# Altium schematic sheet FX_HT32.SchDoc
size A3
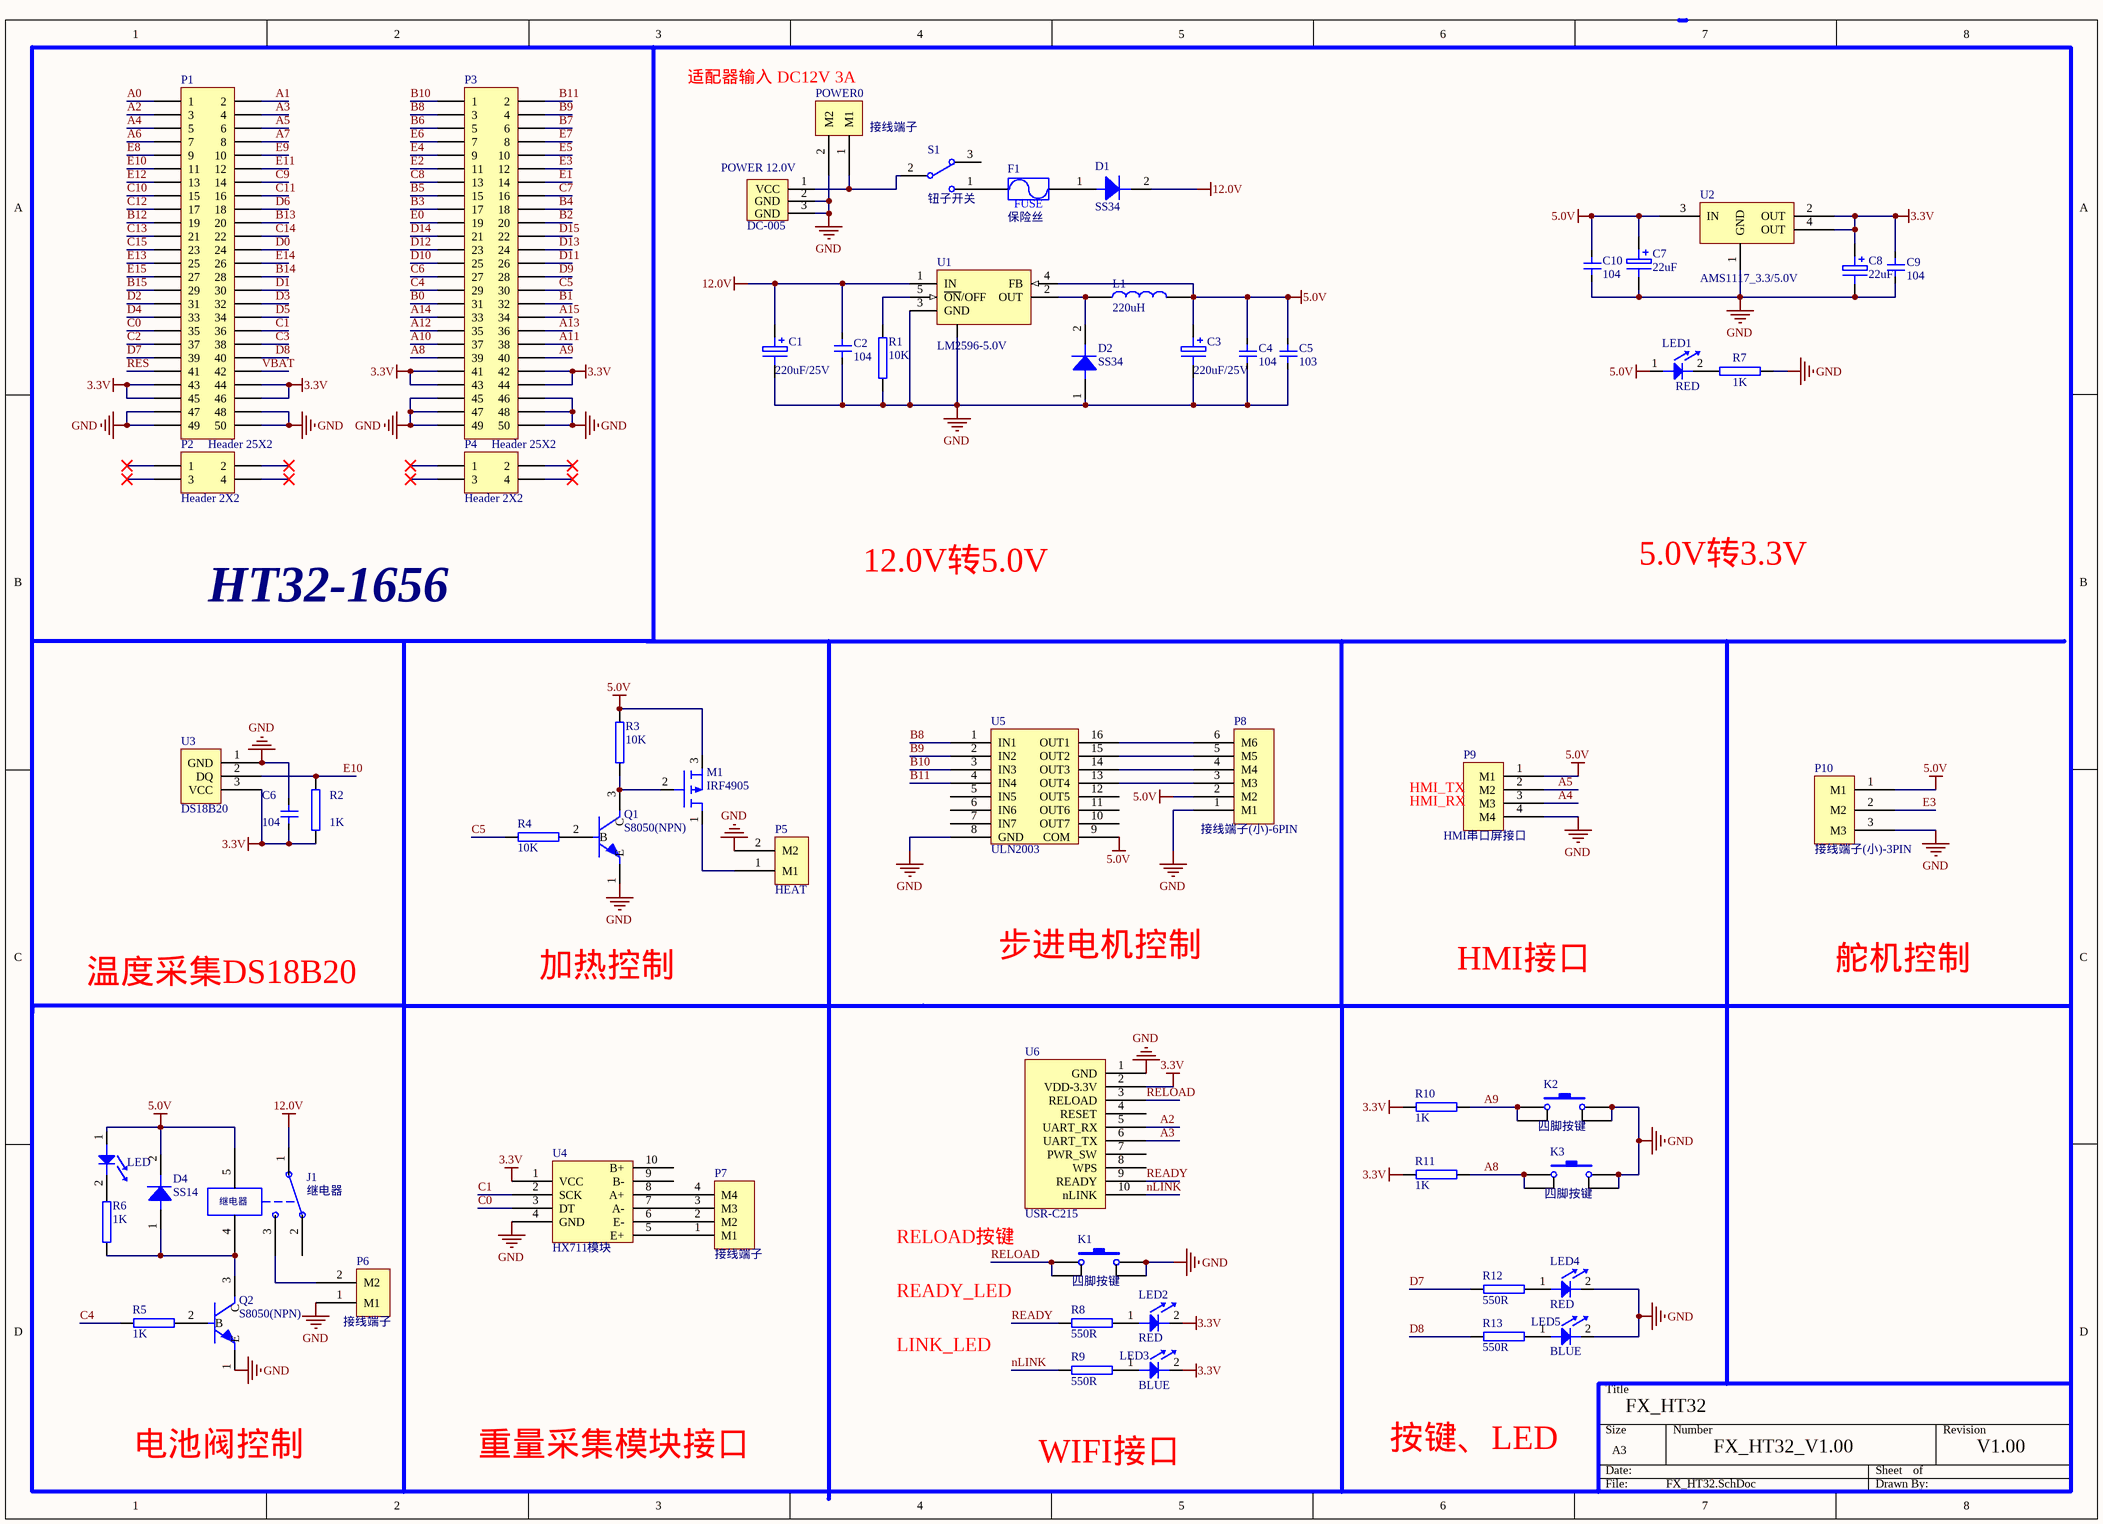
[diagram p0: FX_HT32.SchDoc]

## Parts
?  LED  [0805LED]
C1  220uF/25V  [Cap1(100uF)]
C2  104  [0805C]
C3  220uF/25V  [Cap1(100uF)]
C4  104  [0805C]
C5  103  [0805C]
C6  104  [0805C]
C7  22uF  [Cap122uF)]
C8  22uF  [Cap122uF)]
C9  104  [0805C]
C10  104  [0805C]
D1  SS34  [SS14]
D2  SS34  [SS14]
D4  SS14  [SS14]
F1  保险丝  [1812]
J1  继电器  [继电器]
K1  四脚按键  [SW_PB4_DIP]
K2  四脚按键  [SW_PB4_DIP]
K3  四脚按键  [SW_PB4_DIP]
L1  220uH  [电感 220uh]
LED1  RED  [0805LED]
LED2  RED  [0805LED]
LED3  BLUE  [0805LED]
LED4  RED  [0805LED]
LED5  BLUE  [0805LED]
M1  IRF4905  [IRF4905]
P1  Header 25X2  [HDR2X25]
P2  Header 2X2  [HDR2X2]
P3  Header 25X2  [HDR2X25]
P4  Header 2X2  [HDR2X2]
P5  HEAT  [HEAT]
P6  接线端子  [接线端子(小)-2PIN]
P7  接线端子  [接线端子(小)-4PIN]
P8  接线端子(小)-6PIN  [接线端子(小)-6PIN]
P9  HMI串口屏接口  [接线端子(小)-4PIN]
P10  接线端子(小)-3PIN  [接线端子(小)-3PIN]
POWER0  接线端子  [HEAT]
POWER_12.0V  DC-005  [DC-005]
Q1  S8050(NPN)  [NPN]
Q2  S8050(NPN)  [NPN]
R1  10K  [0805R]
R2  1K  [0805R]
R3  10K  [0805R]
R4  10K  [0805R]
R5  1K  [0805R]
R6  1K  [0805R]
R7  1K  [0805R]
R8  550R  [0805R]
R9  550R  [0805R]
R10  1K  [0805R]
R11  1K  [0805R]
R12  550R  [0805R]
R13  550R  [0805R]
S1  钮子开关  [钮子开关(大)]
U1  LM2596-5.0V  [TO-263-5]
U2  AMS1117_3.3/5.0V  [SOT-223]
U3  DS18B20  [DS18B20]
U4  HX711模块  [HX711模块]
U5  ULN2003  [ULN2003]
U6  USR-C215  [USR-C215]

## Nets
3.3V: C6.1 C8.1 C9.2 LED2.2 LED3.2 P1.43 P1.44 P1.45 P1.46 P3.41 P3.42 P3.43 P3.44 R2.2 R10.1 R11.1 U2.2(OUT) U2.4(OUT) U3.3(VCC) U4.1(VCC) U6.2(VDD-3.3V)
5.0V: ?.1 C3.1 C4.2 C5.2 C7.1 C10.2 D4.2 J1.5 L1.2 LED1.1 M1.3 P8.2(M2) P9.1(M1) P10.1(M1) R3.2 U1.4(FB) U2.3(IN) U5.9(COM)
12.0V: C1.1 C2.2 D1.2 J1.1 U1.1(IN)
GND: C1.2 C2.1 C3.2 C4.1 C5.1 C6.2 C7.2 C8.2 C9.1 C10.1 D2.1 K1.2 K1.3 K2.2 K2.3 K3.2 K3.3 LED4.2 LED5.2 P1.47 P1.48 P1.49 P1.50 P3.45 P3.46 P3.47 P3.48 P3.49 P3.50 P5.2(M2) P6.1(M1) P8.1(M1) P9.4(M4) P10.3(M3) POWER0.2(M2) POWER_12.0V.2(GND) POWER_12.0V.3(GND) Q1.1(E) Q2.1(E) R1.1 R7.2 U1.3(GND) U1.6 U2.1(GND) U3.1(GND) U4.4(GND) U5.8(GND) U6.1(GND)
A0: P1.1
A1: P1.2
A2: P1.3 U6.5(UART_RX)
A3: P1.4 U6.6(UART_TX)
A4: P1.5 P9.3(M3)
A5: P1.6 P9.2(M2)
A6: P1.7
A7: P1.8
A8: K3.1 K3.4 P3.39 R11.2
A9: K2.1 K2.4 P3.40 R10.2
A10: P3.37
A11: P3.38
A12: P3.35
A13: P3.36
A14: P3.33
A15: P3.34
B0: P3.31
B1: P3.32
B2: P3.20
B3: P3.17
B4: P3.18
B5: P3.15
B6: P3.5
B7: P3.6
B8: P3.3 U5.1(IN1)
B9: P3.4 U5.2(IN2)
B10: P3.1 U5.3(IN3)
B11: P3.2 U5.4(IN4)
B12: P1.19
B13: P1.20
B14: P1.28
B15: P1.29
C0: P1.35 U4.3(DT)
C1: P1.36 U4.2(SCK)
C2: P1.37
C3: P1.38
C4: P3.29 R5.1
C5: P3.30 R4.1
C6: P3.27
C7: P3.16
C8: P3.13
C9: P1.14
C10: P1.15
C11: P1.16
C12: P1.17
C13: P1.21
C14: P1.22
C15: P1.23
D0: P1.24
D1: P1.30
D2: P1.31
D3: P1.32
D4: P1.33
D5: P1.34
D6: P1.18
D7: P1.39 R12.1
D8: P1.40 R13.1
D9: P3.28
D10: P3.25
D11: P3.26
D12: P3.23
D13: P3.24
D14: P3.21
D15: P3.22
E0: P3.19
E1: P3.14
E2: P3.11
E3: P3.12 P10.2(M2)
E4: P3.9
E5: P3.10
E6: P3.7
E7: P3.8
E8: P1.9
E9: P1.10
E10: P1.11 R2.1 U3.2(DQ)
E11: P1.12
E12: P1.13
E13: P1.25
E14: P1.26
E15: P1.27
nLINK: R9.1 U6.10(nLINK)
READY: R8.1 U6.9(READY)
RELOAD: K1.1 K1.4 U6.3(RELOAD)
RES: P1.41
VBAT: P1.42
Net?_2: ?.2 R6.1
NetD1_1: D1.1 F1.2
NetD2_2: D2.2 L1.1 U1.2(OUT)
NetD4_1: D4.1 J1.4 Q2.3(C) R6.2
NetF1_1: F1.1 S1.1
NetJ1_3: J1.3 P6.2(M2)
NetLED1_2: LED1.2 R7.1
NetLED2_1: LED2.1 R8.2
NetLED3_1: LED3.1 R9.2
NetLED4_1: LED4.1 R12.2
NetLED5_1: LED5.1 R13.2
NetM1_1: M1.1 P5.1(M1)
NetM1_2: M1.2 Q1.3(C) R3.1
NetP7_1: P7.1(M1) U4.5(E+)
NetP7_2: P7.2(M2) U4.6(E-)
NetP7_3: P7.3(M3) U4.7(A-)
NetP7_4: P7.4(M4) U4.8(A+)
NetP8_3: P8.3(M3) U5.13(OUT4)
NetP8_4: P8.4(M4) U5.14(OUT3)
NetP8_5: P8.5(M5) U5.15(OUT2)
NetP8_6: P8.6(M6) U5.16(OUT1)
NetPOWER0_1: POWER0.1(M1) POWER_12.0V.1(VCC) S1.2
NetQ1_2: Q1.2(B) R4.2
NetQ2_2: Q2.2(B) R5.2
NetR1_2: R1.2 U1.5(~{ON}/OFF)

Not connected (* = marked no-connect by the designer): J1 2; P2 1* 2* 3* 4*; P4 1* 2* 3* 4*; S1 3; U4 9(B-) 10(B+); U5 5(IN5) 6(IN6) 7(IN7) 10(OUT7) 11(OUT6) 12(OUT5); U6 4(RESET) 7(PWR_SW) 8(WPS)

## Notes on the sheet
- (near POWER0) 适配器输入 DC12V 3A
- 12.0V转5.0V
- 5.0V转3.3V
- HT32-1656
- (near P9) HMI_TX
- (near P9) HMI_RX
- 温度采集DS18B20
- 加热控制
- 步进电机控制
- HMI接口
- 舵机控制
- RELOAD按键
- READY_LED
- LINK_LED
- FX_HT32
- 电池阀控制
- 重量采集模块接口
- WIFI接口
- 按键、LED
- FX_HT32_V1.00
- V1.00
- (in symbol F1) FUSE

## Library data of the parts
C1 C3 C7 C8 = Cap1(100uF)
C2 C4-C6 C9 C10 = C1
D1 D2 = SS14
F1 = F1
K1-K3 = Key(四脚)
L1 = L1
LED1-LED5 = LED
P1 P3 = Header 25X2: Header, 25-Pin, Dual row; LatestRevisionDate: 17-Jul-2002; LatestRevisionNote: Re-released for DXP Platform.; Publisher: Altium Limited
P2 P4 = Header 2X2: Header, 2-Pin, Dual row; LatestRevisionDate: 17-Jul-2002; LatestRevisionNote: Re-released for DXP Platform.; Publisher: Altium Limited
P5 P6 POWER0 = 接线端子(小)-2PIN
P7 P9 = 接线端子(小)-4PIN
Q1 Q2 = Q2
R1-R13 = R1
U1 = LM2596
U2 = AMS1117-3.3V/5.0V